# Altium project ChiptunePlayer-2.22-AudioShieldAYYM.PrjPCB
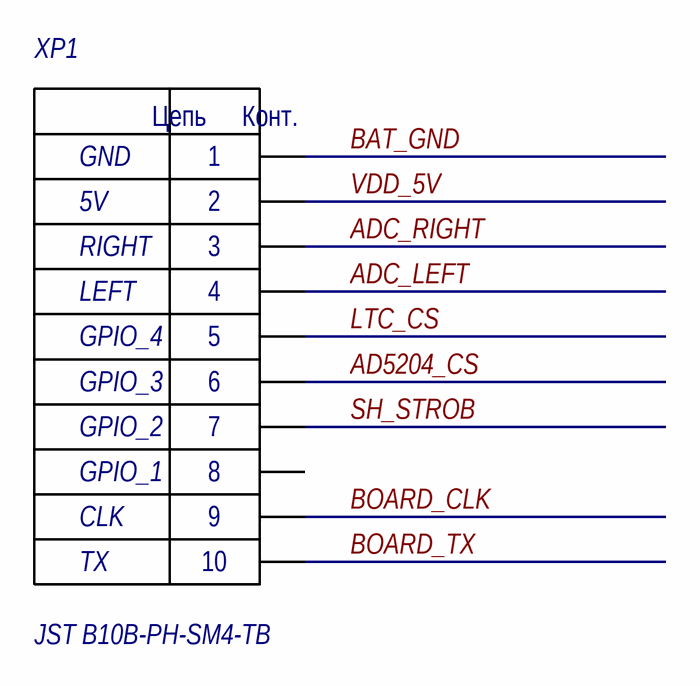
[diagram p0: Connectors.SchDoc]
10 sheets, 77 parts. Net scope: global (net labels, ports and power ports of the same name join across sheets).
Board file: Main.PcbDoc
Sheets:
  Connectors.SchDoc
  Power5VManagement.SchDoc
  Mixer.SchDoc
  ShiftRegister.SchDoc
  Generator28.SchDoc
  Generator40.SchDoc
  DigitalPotentiometers.SchDoc
  AudioAmplifier.SchDoc
  Adc.SchDoc
  ClockGenerator.SchDoc

## Sheet Connectors.SchDoc
size 420 x 297 mm; DocumentNumber: Connectors

### Parts
XP1  JST B10B-PH-SM4-TB  [B10B-PH-SM4-TB]

### Nets
BAT_GND: XP1.1
VDD_5V: XP1.2
AD5204_CS: XP1.6
ADC_LEFT: XP1.4
ADC_RIGHT: XP1.3
BOARD_CLK: XP1.9
BOARD_TX: XP1.10
LTC_CS: XP1.5
SH_STROB: XP1.7

Not connected (* = marked no-connect by the designer): XP1 8

### Notes on the sheet
- GND
- RIGHT
- 5V
- GPIO_3
- GPIO_4
- LEFT
- GPIO_1
- GPIO_2
- TX
- CLK
- Подп. и дата
- Инв. № дубл.
- Взам. инв. №
- Инв. № подл.
- Лист
- Изм.
- № докум.
- Подп.
- Дата
- Копировал
- Формат А3
- (in symbol JST B10B-PH-SM4-TB) Цепь; Конт.

### Library data of the parts
XP1 = JST B10B-PH-SM4-TB: PLS connector; Manufacturer: NONAME; Connector type: Вилка на плату; Number of contacts: 10; Type: Разъем штыревой

## Sheet Power5VManagement.SchDoc
size 420 x 297 mm; DocumentNumber: PowerManagement
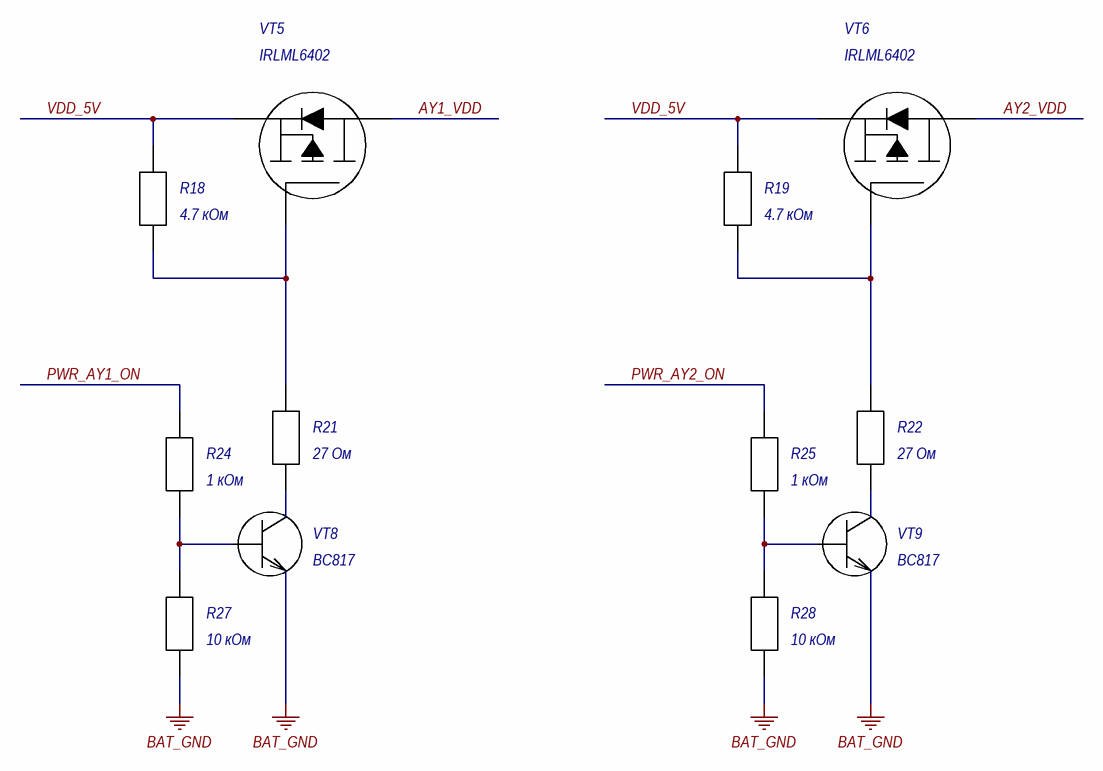
[diagram p1: Power5VManagement.SchDoc]

### Parts
R18  4.7 кОм  [RES 0402]
R19  4.7 кОм  [RES 0402]
R21  27 Ом  [RES 0402]
R22  27 Ом  [RES 0402]
R24  1 кОм  [RES 0402]
R25  1 кОм  [RES 0402]
R27  10 кОм  [RES 0402]
R28  10 кОм  [RES 0402]
VT5  IRLML6402  [SOT-23]
VT6  IRLML6402  [SOT-23]
VT8  BC817  [SOT-23]
VT9  BC817  [SOT-23]

### Nets
AY1_VDD: VT5.3(D)
AY2_VDD: VT6.3(D)
BAT_GND: R27.1 R28.1 VT8.2(E) VT9.2(E)
VDD_5V: R18.2 R19.2 VT5.2(S) VT6.2(S)
PWR_AY1_ON: R24.2
PWR_AY2_ON: R25.2
NetR18_1: R18.1 R21.2 VT5.1(G)
NetR19_1: R19.1 R22.2 VT6.1(G)
NetR21_1: R21.1 VT8.3(C)
NetR22_1: R22.1 VT9.3(C)
NetR24_1: R24.1 R27.2 VT8.1(B)
NetR25_1: R25.1 R28.2 VT9.1(B)

### Notes on the sheet
- Подп. и дата
- Инв. № дубл.
- Взам. инв. №
- Инв. № подл.
- Лист
- Изм.
- № докум.
- Подп.
- Дата
- Копировал
- Формат А3

### Library data of the parts
R18 R19 R21 R22 R24 R25 R27 R28 = RES 0402
VT8 VT9 = BC817: NPN general-purpose transistor; Manufacturer: NXP; Structure: n-p-n; Type: Транзистор биполярный; hFE: 160 ... 600; Max collector-emitter voltage: 45 В; Max collector-base voltage: 50 В; Max emitter-base voltage: 5 В; Max collector current: 0,5 А; Max collector peak current: 1 А; Power dissitipation: 0,25 Вт; fT: 100 МГц; Collector-emitter saturation voltage: 0,7 В; Base-emitter on voltage: 1,2 В; Specitication: ЭКБ ИП; Collector-base сapacitance: 3 пФ; Complement: BC807; Temperature range: -65 ... 150 °C

## Sheet Mixer.SchDoc
size 420 x 297 mm; DocumentNumber: Audio output
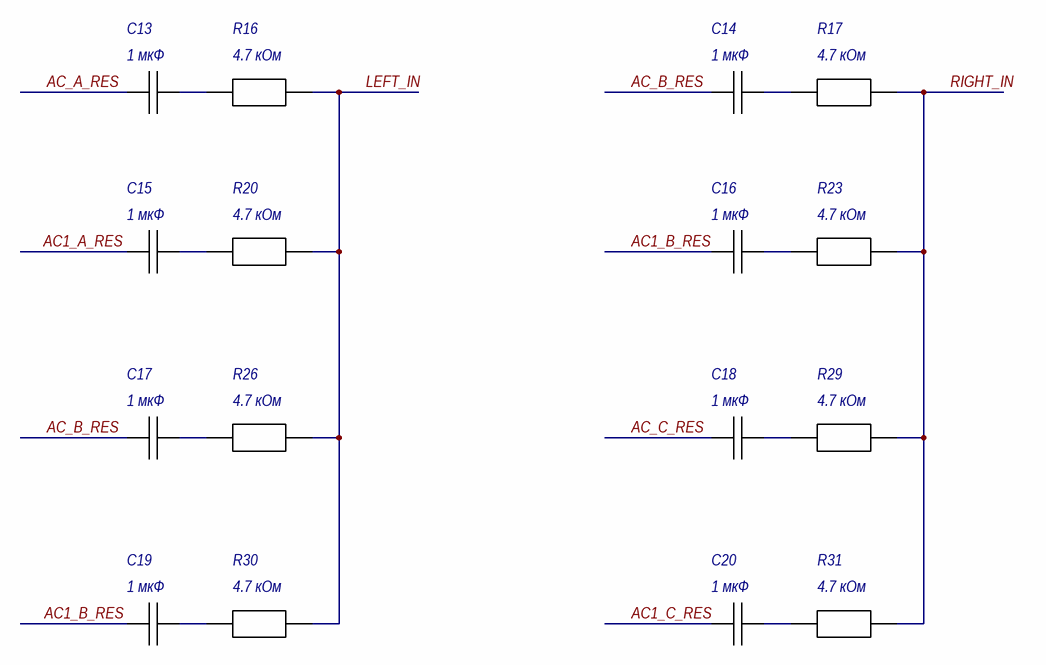
[diagram p2: Mixer.SchDoc]

### Parts
C13  1 мкФ  [C 1206]
C14  1 мкФ  [C 1206]
C15  1 мкФ  [C 1206]
C16  1 мкФ  [C 1206]
C17  1 мкФ  [C 1206]
C18  1 мкФ  [C 1206]
C19  1 мкФ  [C 1206]
C20  1 мкФ  [C 1206]
R16  4.7 кОм  [RES 0805]
R17  4.7 кОм  [RES 0805]
R20  4.7 кОм  [RES 0805]
R23  4.7 кОм  [RES 0805]
R26  4.7 кОм  [RES 0805]
R29  4.7 кОм  [RES 0805]
R30  4.7 кОм  [RES 0805]
R31  4.7 кОм  [RES 0805]

### Nets
AC1_A_RES: C15.1
AC1_B_RES: C16.1 C19.1
AC1_C_RES: C20.1
AC_A_RES: C13.1
AC_B_RES: C14.1 C17.1
AC_C_RES: C18.1
LEFT_IN: R16.2 R20.2 R26.2 R30.2
RIGHT_IN: R17.2 R23.2 R29.2 R31.2
NetC13_2: C13.2 R16.1
NetC14_2: C14.2 R17.1
NetC15_2: C15.2 R20.1
NetC16_2: C16.2 R23.1
NetC17_2: C17.2 R26.1
NetC18_2: C18.2 R29.1
NetC19_2: C19.2 R30.1
NetC20_2: C20.2 R31.1

### Notes on the sheet
- Подп. и дата
- Инв. № дубл.
- Взам. инв. №
- Инв. № подл.
- Лист
- Изм.
- № докум.
- Подп.
- Дата
- Копировал
- Формат А3

### Library data of the parts
C13-C20 = CAP 1206: SMD Capacitor 1206; Manufacturer: /Укажите компанию-производителя/; Tolerance: /Укажите допуск в процентах/; Temperature coefficient: /Формат: ±? ppm/°C/; Type: Конденсатор керамический; TC: /Укажите тип диэлектрика/; Size: 1206; Temperature range: /Формат: -? ... ? °C/
R16 R17 R20 R23 R26 R29-R31 = RES 0805

## Sheet ShiftRegister.SchDoc
size 420 x 297 mm; DocumentNumber: Audio core
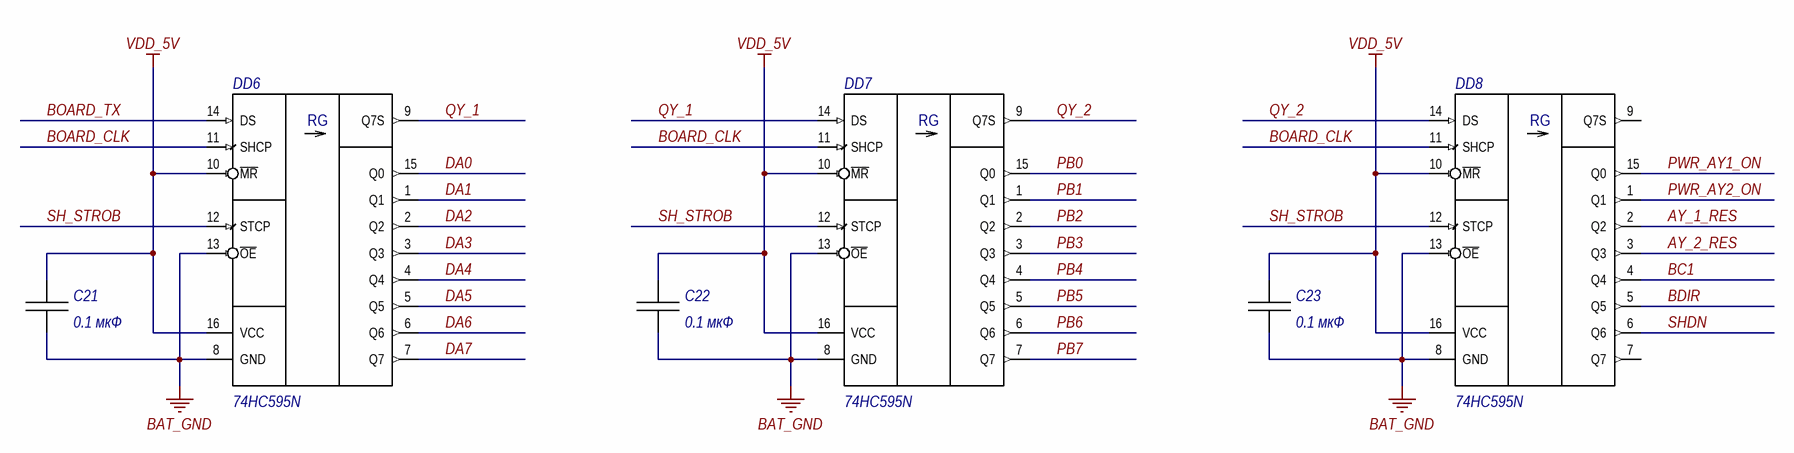
[diagram p3: ShiftRegister.SchDoc]

### Parts
C21  0.1 мкФ  [C 1206]
C22  0.1 мкФ  [C 1206]
C23  0.1 мкФ  [C 1206]
DD6  74HC595N  [SO16]
DD7  74HC595N  [SO16]
DD8  74HC595N  [SO16]

### Nets
BAT_GND: C21.2 C22.2 C23.2 DD6.8(GND) DD6.13(~{OE}) DD7.8(GND) DD7.13(~{OE}) DD8.8(GND) DD8.13(~{OE})
VDD_5V: C21.1 C22.1 C23.1 DD6.10(~{MR}) DD6.16(VCC) DD7.10(~{MR}) DD7.16(VCC) DD8.10(~{MR}) DD8.16(VCC)
AY_1_RES: DD8.2(Q2)
AY_2_RES: DD8.3(Q3)
BC1: DD8.4(Q4)
BDIR: DD8.5(Q5)
BOARD_CLK: DD6.11(SHCP) DD7.11(SHCP) DD8.11(SHCP)
BOARD_TX: DD6.14(DS)
DA0: DD6.15(Q0)
DA1: DD6.1(Q1)
DA2: DD6.2(Q2)
DA3: DD6.3(Q3)
DA4: DD6.4(Q4)
DA5: DD6.5(Q5)
DA6: DD6.6(Q6)
DA7: DD6.7(Q7)
PB0: DD7.15(Q0)
PB1: DD7.1(Q1)
PB2: DD7.2(Q2)
PB3: DD7.3(Q3)
PB4: DD7.4(Q4)
PB5: DD7.5(Q5)
PB6: DD7.6(Q6)
PB7: DD7.7(Q7)
PWR_AY1_ON: DD8.15(Q0)
PWR_AY2_ON: DD8.1(Q1)
QY_1: DD6.9(Q7S) DD7.14(DS)
QY_2: DD7.9(Q7S) DD8.14(DS)
SH_STROB: DD6.12(STCP) DD7.12(STCP) DD8.12(STCP)
SHDN: DD8.6(Q6)

Not connected (* = marked no-connect by the designer): DD8 7(Q7) 9(Q7S)

### Notes on the sheet
- Подп. и дата
- Инв. № дубл.
- Взам. инв. №
- Инв. № подл.
- Лист
- Изм.
- № докум.
- Подп.
- Дата
- Копировал
- Формат А3
- (in symbol 74HC595N) RG

### Library data of the parts
C21-C23 = CAP 1206: as C13 on sheet Mixer; Size: 1206; Temperature range: /Формат: -? ... ? °C/; Value: 0.1 мкФ

## Sheet Generator28.SchDoc
size 420 x 297 mm; DocumentNumber: Audio core
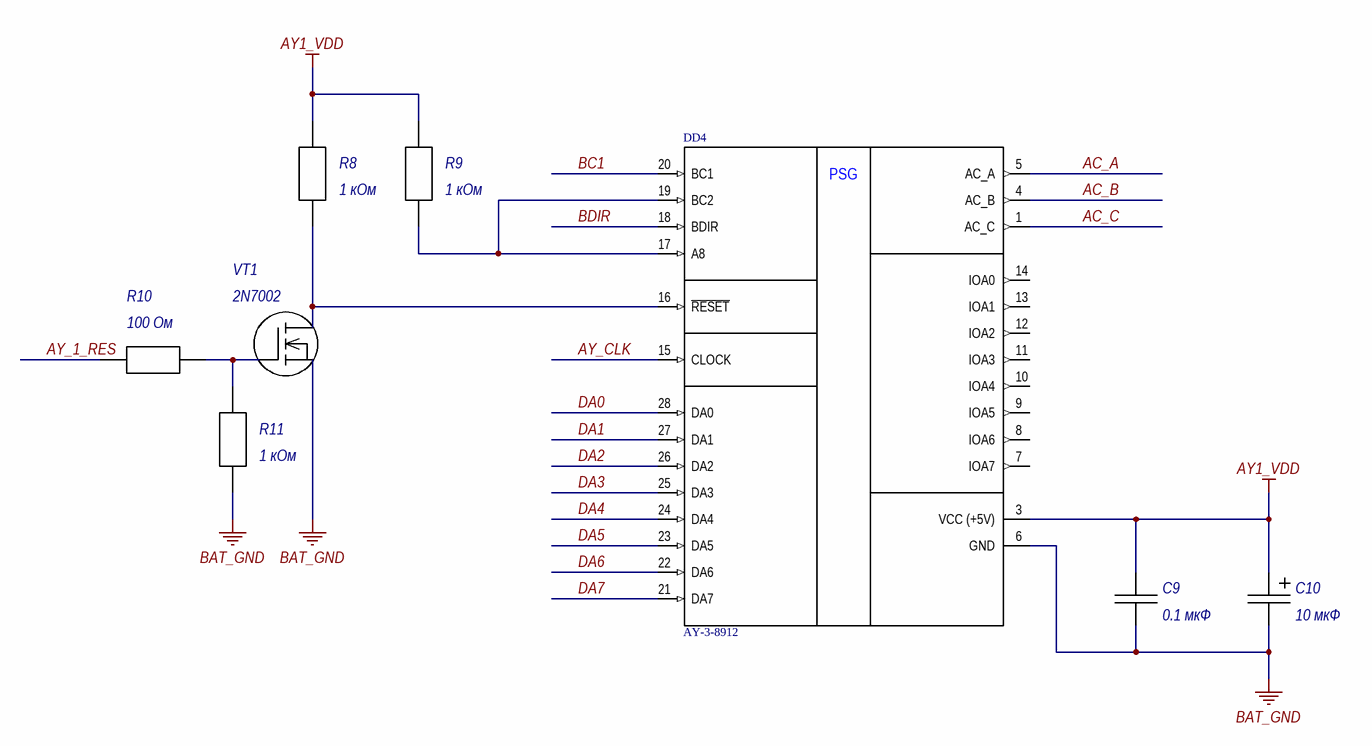
[diagram p4: Generator28.SchDoc]

### Parts
C9  0.1 мкФ  [C 1206]
C10  10 мкФ  [C TAN_A]
DD4  AY-3-8912  [DIP28_PLUS_MCU]
R8  1 кОм  [RES 0805]
R9  1 кОм  [RES 0805]
R10  100 Ом  [RES 0805]
R11  1 кОм  [RES 0805]
VT1  2N7002  [SOT-23]

### Nets
AY1_VDD: C9.1 C10.1 DD4.3(VCC_(+5V)) R8.2 R9.1
BAT_GND: C9.2 C10.2 DD4.6(GND) R11.1 VT1.2(S)
AC_A: DD4.5(AC_A)
AC_B: DD4.4(AC_B)
AC_C: DD4.1(AC_C)
AY_1_RES: R10.1
AY_CLK: DD4.15(CLOCK)
BC1: DD4.20(BC1)
BDIR: DD4.18(BDIR)
DA0: DD4.28(DA0)
DA1: DD4.27(DA1)
DA2: DD4.26(DA2)
DA3: DD4.25(DA3)
DA4: DD4.24(DA4)
DA5: DD4.23(DA5)
DA6: DD4.22(DA6)
DA7: DD4.21(DA7)
NetDD4_16: DD4.16(~{RESET}) R8.1 VT1.3(D)
NetDD4_17: DD4.17(A8) DD4.19(BC2) R9.2
NetR10_2: R10.2 R11.2 VT1.1(G)

Not connected (* = marked no-connect by the designer): DD4 7(IOA7) 8(IOA6) 9(IOA5) 10(IOA4) 11(IOA3) 12(IOA2) 13(IOA1) 14(IOA0)

### Notes on the sheet
- Подп. и дата
- Инв. № дубл.
- Взам. инв. №
- Инв. № подл.
- Лист
- Изм.
- № докум.
- Подп.
- Дата
- Копировал
- Формат А3
- (in symbol AY-3-8912) PSG

### Library data of the parts
C9 = CAP 1206: as C13 on sheet Mixer; Size: 1206; Temperature range: /Формат: -? ... ? °C/; Value: 0.1 мкФ
C10 = CAP TAN_A: SMD Tantalium Capacitor A; Type: Конденсатор танталовый; Rated voltage: 10 В; Size: A
R8-R11 = RES 0805
VT1 = 2N7002: 60 V, 300 mA N-channel Trench MOSFET; Manufacturer: NXP; Structure: Индуцированный канал n-типа; Type: Транзистор полевой с изолированным затвором; Max gate-to-source voltage: 30 В; Drain-to-source breakdown voltage: 60 В; Gate threshold voltage: 2 В; Max continuous drain current: 300 мА; Max pulsed drain current: 1,2 А; Power dissitipation: 0,83 Вт; Input capacitance: 31 пФ; Output capacitance: 6,8 пФ; Turn-on time: 2,5 нс; Reverse transfer capacitance: 3,5 пФ; Turn-off time: 11 нс; Rds: 2,8 Ом; Temperature range: -65 ... 150 °C

## Sheet Generator40.SchDoc
size 420 x 297 mm; DocumentNumber: Audio core
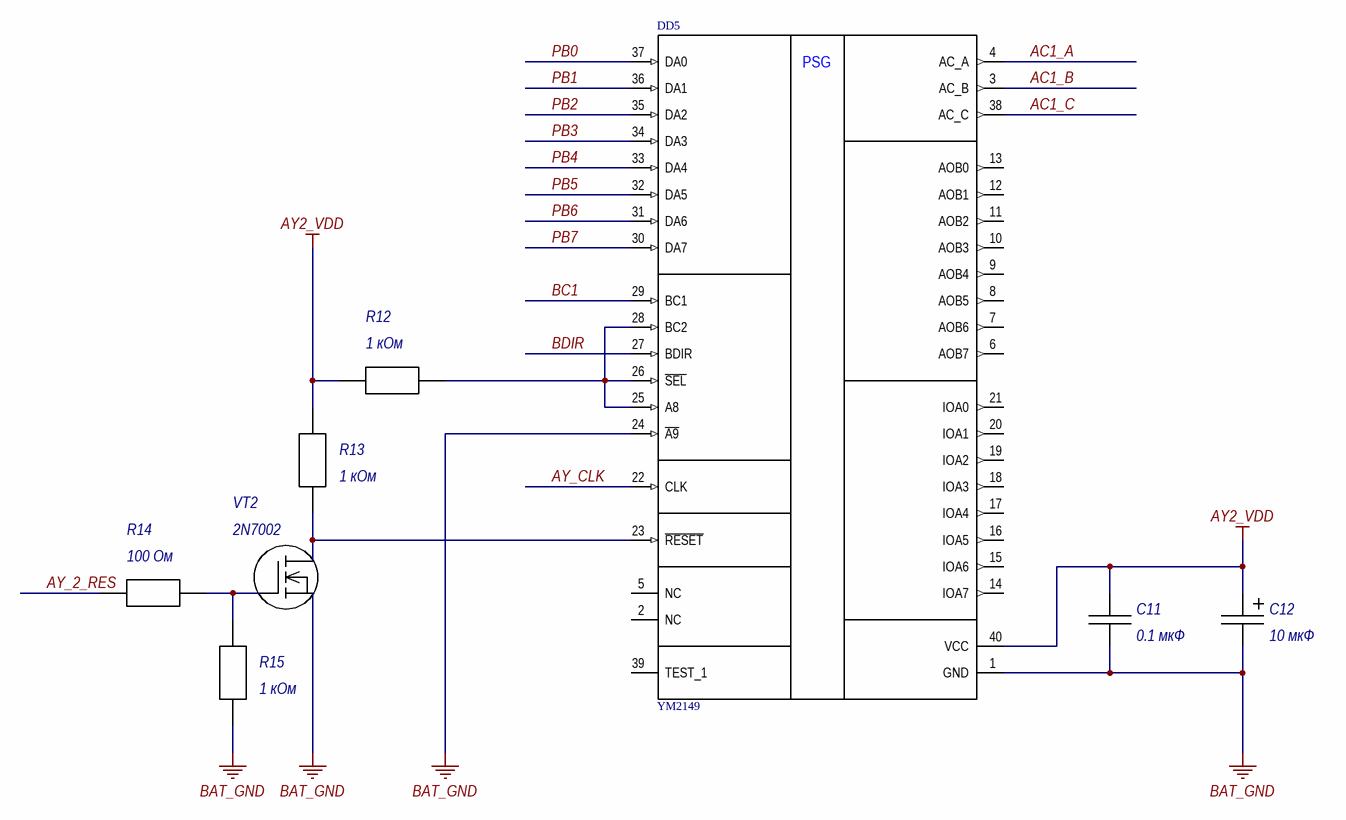
[diagram p5: Generator40.SchDoc]

### Parts
C11  0.1 мкФ  [C 1206]
C12  10 мкФ  [C TAN_A]
DD5  YM2149  [DIP40_PLUS_MCU]
R12  1 кОм  [RES 0805]
R13  1 кОм  [RES 0805]
R14  100 Ом  [RES 0805]
R15  1 кОм  [RES 0805]
VT2  2N7002  [SOT-23]

### Nets
AY2_VDD: C11.1 C12.1 DD5.40(VCC) R12.2 R13.2
BAT_GND: C11.2 C12.2 DD5.1(GND) DD5.24(~{A9}) R15.1 VT2.2(S)
AC1_A: DD5.4(AC_A)
AC1_B: DD5.3(AC_B)
AC1_C: DD5.38(AC_C)
AY_2_RES: R14.1
AY_CLK: DD5.22(CLK)
BC1: DD5.29(BC1)
BDIR: DD5.27(BDIR)
PB0: DD5.37(DA0)
PB1: DD5.36(DA1)
PB2: DD5.35(DA2)
PB3: DD5.34(DA3)
PB4: DD5.33(DA4)
PB5: DD5.32(DA5)
PB6: DD5.31(DA6)
PB7: DD5.30(DA7)
NetDD5_23: DD5.23(~{RESET}) R13.1 VT2.3(D)
NetDD5_25: DD5.25(A8) DD5.26(~{SEL}) DD5.28(BC2) R12.1
NetR14_2: R14.2 R15.2 VT2.1(G)

Not connected (* = marked no-connect by the designer): DD5 2(NC) 5(NC) 6(AOB7) 7(AOB6) 8(AOB5) 9(AOB4) 10(AOB3) 11(AOB2) 12(AOB1) 13(AOB0) 14(IOA7) 15(IOA6) 16(IOA5) 17(IOA4) 18(IOA3) 19(IOA2) 20(IOA1) 21(IOA0) 39(TEST_1)

### Notes on the sheet
- Подп. и дата
- Инв. № дубл.
- Взам. инв. №
- Инв. № подл.
- Лист
- Изм.
- № докум.
- Подп.
- Дата
- Копировал
- Формат А3
- (in symbol YM2149) PSG

### Library data of the parts
C11 = CAP 1206: as C13 on sheet Mixer; Size: 1206; Temperature range: /Формат: -? ... ? °C/; Value: 0.1 мкФ
C12 = CAP TAN_A: as C10 on sheet Generator28; Size: A
R12-R15 = RES 0805
VT2 = 2N7002: as VT1 on sheet Generator28; Temperature range: -65 ... 150 °C

## Sheet DigitalPotentiometers.SchDoc
size 420 x 297 mm; DocumentNumber: Audio output
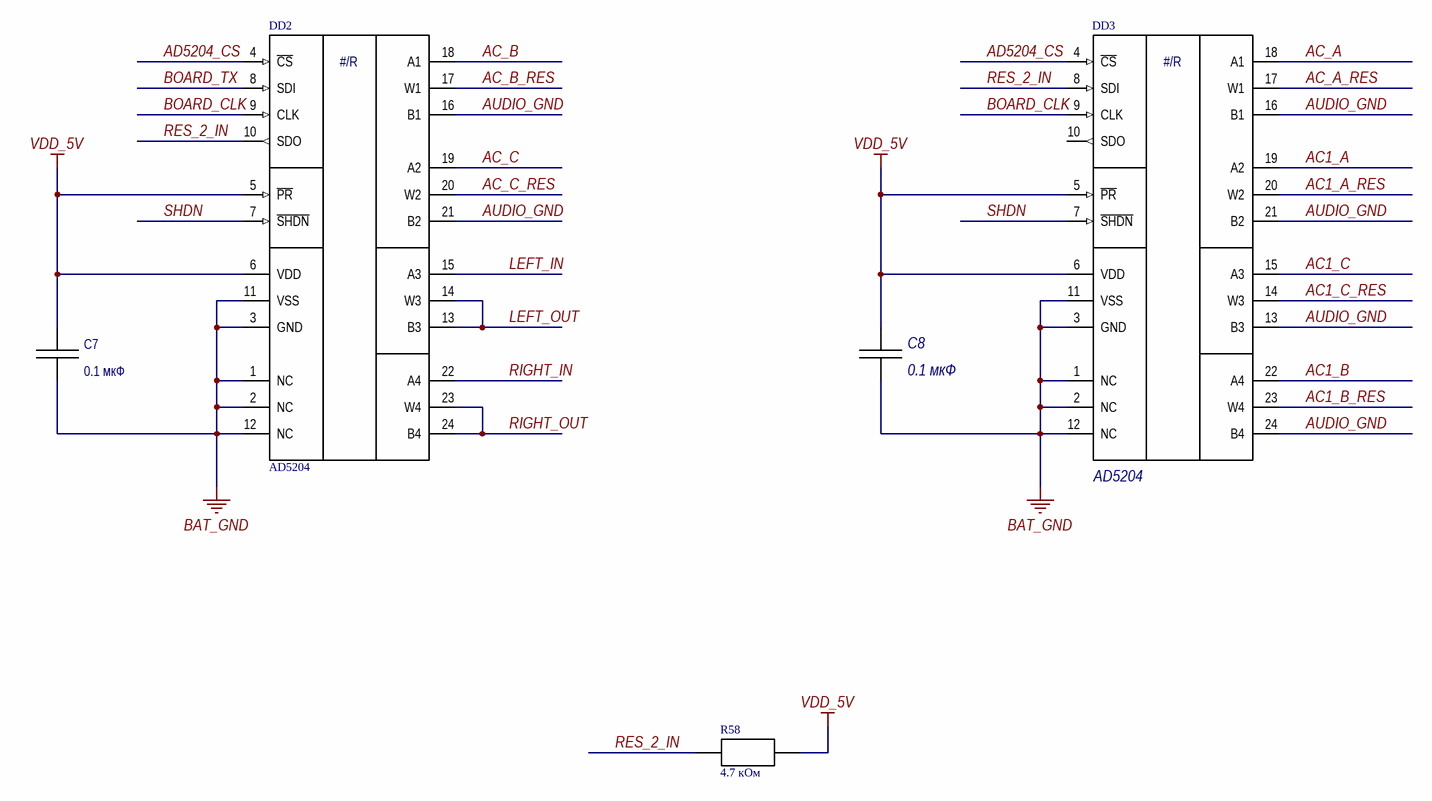
[diagram p6: DigitalPotentiometers.SchDoc]

### Parts
C7  0.1 мкФ  [C 1206]
C8  0.1 мкФ  [C 1206]
DD2  AD5204  [TSSOP-24]
DD3  AD5204  [TSSOP-24]
R58  4.7 кОм  [RES 0805]

### Nets
AUDIO_GND: DD2.16(B1) DD2.21(B2) DD3.13(B3) DD3.16(B1) DD3.21(B2) DD3.24(B4)
BAT_GND: C7.2 C8.2 DD2.1(NC) DD2.2(NC) DD2.3(GND) DD2.11(VSS) DD2.12(NC) DD3.1(NC) DD3.2(NC) DD3.3(GND) DD3.11(VSS) DD3.12(NC)
VDD_5V: C7.1 C8.1 DD2.5(~{PR}) DD2.6(VDD) DD3.5(~{PR}) DD3.6(VDD) R58.2
AC1_A: DD3.19(A2)
AC1_A_RES: DD3.20(W2)
AC1_B: DD3.22(A4)
AC1_B_RES: DD3.23(W4)
AC1_C: DD3.15(A3)
AC1_C_RES: DD3.14(W3)
AC_A: DD3.18(A1)
AC_A_RES: DD3.17(W1)
AC_B: DD2.18(A1)
AC_B_RES: DD2.17(W1)
AC_C: DD2.19(A2)
AC_C_RES: DD2.20(W2)
AD5204_CS: DD2.4(~{CS}) DD3.4(~{CS})
BOARD_CLK: DD2.9(CLK) DD3.9(CLK)
BOARD_TX: DD2.8(SDI)
LEFT_IN: DD2.15(A3)
LEFT_OUT: DD2.13(B3) DD2.14(W3)
RES_2_IN: DD2.10(SDO) DD3.8(SDI) R58.1
RIGHT_IN: DD2.22(A4)
RIGHT_OUT: DD2.23(W4) DD2.24(B4)
SHDN: DD2.7(~{SHDN}) DD3.7(~{SHDN})

Not connected (* = marked no-connect by the designer): DD3 10(SDO)

### Notes on the sheet
- Подп. и дата
- Инв. № дубл.
- Взам. инв. №
- Инв. № подл.
- Лист
- Изм.
- № докум.
- Подп.
- Дата
- Копировал
- Формат А3
- (in symbol AD5204) #/R

### Library data of the parts
C7 C8 = CAP 1206: as C13 on sheet Mixer; Size: 1206; Temperature range: /Формат: -? ... ? °C/; Value: 0.1 мкФ
R58 = RES 0805

## Sheet AudioAmplifier.SchDoc
size 420 x 297 mm; DocumentNumber: Audio output
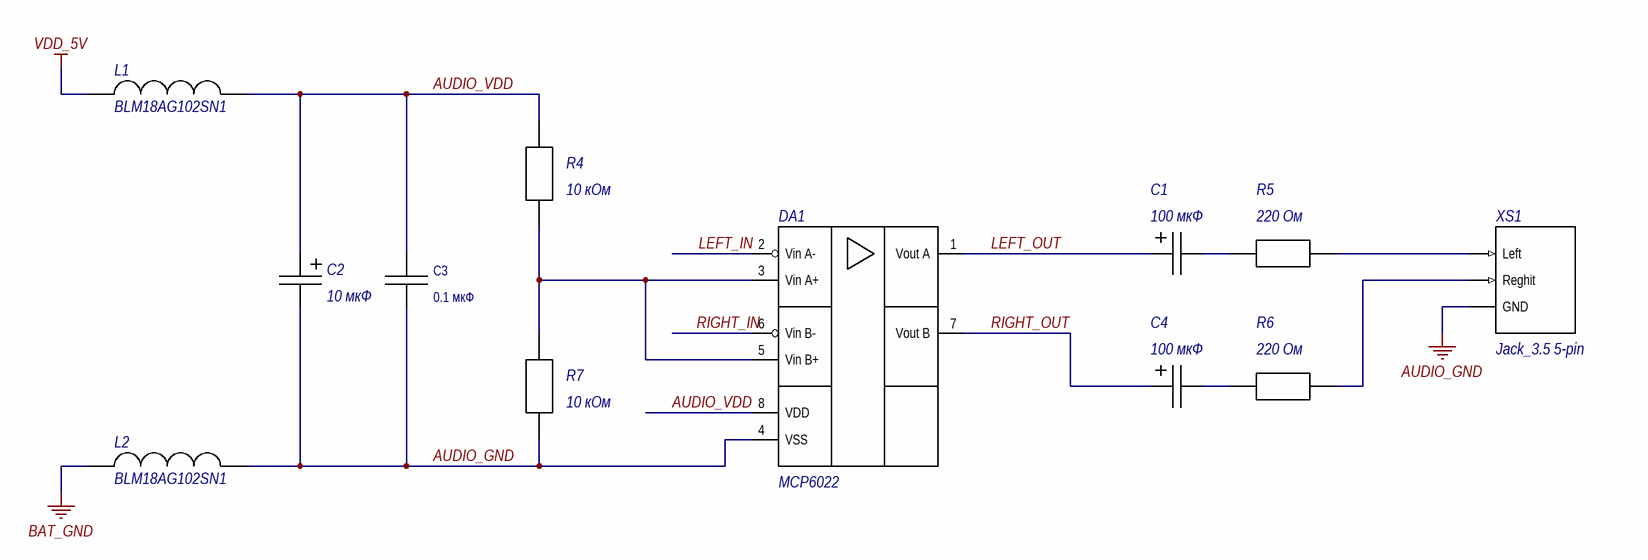
[diagram p7: AudioAmplifier.SchDoc]

### Parts
C1  100 мкФ  [C TAN_C]
C2  10 мкФ  [C TAN_A]
C3  0.1 мкФ  [C 1206]
C4  100 мкФ  [C TAN_C]
DA1  MCP6022  [SOIC-8]
L1  BLM18AG102SN1  [FB 0603]
L2  BLM18AG102SN1  [FB 0603]
R4  10 кОм  [RES 0805]
R5  220 Ом  [RES 0805]
R6  220 Ом  [RES 0805]
R7  10 кОм  [RES 0805]
XS1  Jack_3.5 5-pin  [JACK 3.5 DIP]

### Nets
AUDIO_GND: C2.2 C3.2 DA1.4(VSS) L2.2 R7.1 XS1.G(GND)
BAT_GND: L2.1
VDD_5V: L1.1
AUDIO_VDD: C2.1 C3.1 DA1.8(VDD) L1.2 R4.2
LEFT_IN: DA1.2(Vin_A-)
LEFT_OUT: C1.1 DA1.1(Vout_A)
RIGHT_IN: DA1.6(Vin_B-)
RIGHT_OUT: C4.1 DA1.7(Vout_B)
NetC1_2: C1.2 R5.1
NetC4_2: C4.2 R6.1
NetDA1_3: DA1.3(Vin_A+) DA1.5(Vin_B+) R4.1 R7.2
NetR5_2: R5.2 XS1.L(Left)
NetR6_2: R6.2 XS1.R(Reghit)

### Notes on the sheet
- Подп. и дата
- Инв. № дубл.
- Взам. инв. №
- Инв. № подл.
- Лист
- Изм.
- № докум.
- Подп.
- Дата
- Копировал
- Формат А3

### Library data of the parts
C1 C4 = CAP TAN_C: SMD Tantalium Capacitor C; Type: Конденсатор танталовый; Size: C
C2 = CAP TAN_A: as C10 on sheet Generator28; Size: A
C3 = CAP 1206: as C13 on sheet Mixer; Size: 1206; Temperature range: /Формат: -? ... ? °C/; Value: 0.1 мкФ
R4-R7 = RES 0805

## Sheet Adc.SchDoc
size 420 x 297 mm; DocumentNumber: Audio output
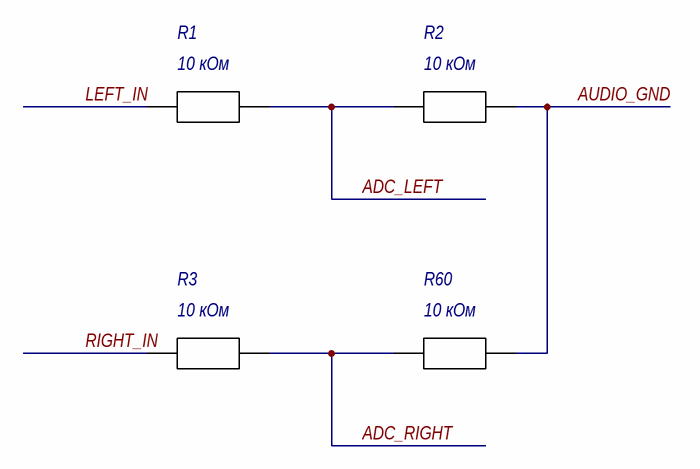
[diagram p8: Adc.SchDoc]

### Parts
R1  10 кОм  [RES 0805]
R2  10 кОм  [RES 0805]
R3  10 кОм  [RES 0805]
R60  10 кОм  [RES 0805]

### Nets
AUDIO_GND: R2.1 R60.1
ADC_LEFT: R1.1 R2.2
ADC_RIGHT: R3.1 R60.2
LEFT_IN: R1.2
RIGHT_IN: R3.2

### Notes on the sheet
- Подп. и дата
- Инв. № дубл.
- Взам. инв. №
- Инв. № подл.
- Лист
- Изм.
- № докум.
- Подп.
- Дата
- Копировал
- Формат А3

### Library data of the parts
R1-R3 R60 = RES 0805

## Sheet ClockGenerator.SchDoc
size 420 x 297 mm; DocumentNumber: ClockGenerator
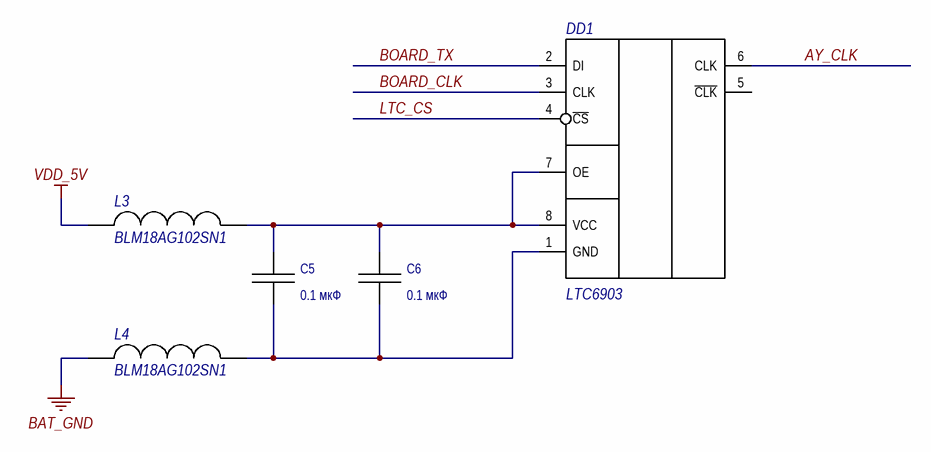
[diagram p9: ClockGenerator.SchDoc]

### Parts
C5  value 0.1 мкФ  [C 1206]  (hidden comment: 1 мкФ)
C6  value 0.1 мкФ  [C 1206]  (hidden comment: 2.2 мкФ)
DD1  LTC6903  [MSOP_MS8]
L3  BLM18AG102SN1  [FB 0603]
L4  BLM18AG102SN1  [FB 0603]

### Nets
BAT_GND: L4.1
VDD_5V: L3.1
AY_CLK: DD1.6(CLK)
BOARD_CLK: DD1.3(CLK)
BOARD_TX: DD1.2(DI)
LTC_CS: DD1.4(~{CS})
NetC5_1: C5.1 C6.1 DD1.7(OE) DD1.8(VCC) L3.2
NetC5_2: C5.2 C6.2 DD1.1(GND) L4.2

Not connected (* = marked no-connect by the designer): DD1 5(~{CLK})

### Notes on the sheet
- Подп. и дата
- Инв. № дубл.
- Взам. инв. №
- Инв. № подл.
- Лист
- Изм.
- № докум.
- Подп.
- Дата
- Копировал
- Формат А3

### Library data of the parts
C5 C6 = CAP 1206: as C13 on sheet Mixer; Size: 1206; Temperature range: /Формат: -? ... ? °C/

## Nets that join several sheets
AUDIO_GND: DigitalPotentiometers (6 pins), AudioAmplifier (6 pins), Adc (R2.1 R60.1)
AY1_VDD: Power5VManagement (VT5.3), Generator28 (5 pins)
AY2_VDD: Power5VManagement (VT6.3), Generator40 (5 pins)
BAT_GND: Connectors (XP1.1), Power5VManagement (R27.1 R28.1 VT8.2 VT9.2), ShiftRegister (9 pins), Generator28 (5 pins), Generator40 (6 pins), DigitalPotentiometers (12 pins), AudioAmplifier (L2.1), ClockGenerator (L4.1)
VDD_5V: Connectors (XP1.2), Power5VManagement (R18.2 R19.2 VT5.2 VT6.2), ShiftRegister (9 pins), DigitalPotentiometers (7 pins), AudioAmplifier (L1.1), ClockGenerator (L3.1)
AC1_A: Generator40 (DD5.4), DigitalPotentiometers (DD3.19)
AC1_A_RES: Mixer (C15.1), DigitalPotentiometers (DD3.20)
AC1_B: Generator40 (DD5.3), DigitalPotentiometers (DD3.22)
AC1_B_RES: Mixer (C16.1 C19.1), DigitalPotentiometers (DD3.23)
AC1_C: Generator40 (DD5.38), DigitalPotentiometers (DD3.15)
AC1_C_RES: Mixer (C20.1), DigitalPotentiometers (DD3.14)
AC_A: Generator28 (DD4.5), DigitalPotentiometers (DD3.18)
AC_A_RES: Mixer (C13.1), DigitalPotentiometers (DD3.17)
AC_B: Generator28 (DD4.4), DigitalPotentiometers (DD2.18)
AC_B_RES: Mixer (C14.1 C17.1), DigitalPotentiometers (DD2.17)
AC_C: Generator28 (DD4.1), DigitalPotentiometers (DD2.19)
AC_C_RES: Mixer (C18.1), DigitalPotentiometers (DD2.20)
AD5204_CS: Connectors (XP1.6), DigitalPotentiometers (DD2.4 DD3.4)
ADC_LEFT: Connectors (XP1.4), Adc (R1.1 R2.2)
ADC_RIGHT: Connectors (XP1.3), Adc (R3.1 R60.2)
AY_1_RES: ShiftRegister (DD8.2), Generator28 (R10.1)
AY_2_RES: ShiftRegister (DD8.3), Generator40 (R14.1)
AY_CLK: Generator28 (DD4.15), Generator40 (DD5.22), ClockGenerator (DD1.6)
BC1: ShiftRegister (DD8.4), Generator28 (DD4.20), Generator40 (DD5.29)
BDIR: ShiftRegister (DD8.5), Generator28 (DD4.18), Generator40 (DD5.27)
BOARD_CLK: Connectors (XP1.9), ShiftRegister (DD6.11 DD7.11 DD8.11), DigitalPotentiometers (DD2.9 DD3.9), ClockGenerator (DD1.3)
BOARD_TX: Connectors (XP1.10), ShiftRegister (DD6.14), DigitalPotentiometers (DD2.8), ClockGenerator (DD1.2)
DA0: ShiftRegister (DD6.15), Generator28 (DD4.28)
DA1: ShiftRegister (DD6.1), Generator28 (DD4.27)
DA2: ShiftRegister (DD6.2), Generator28 (DD4.26)
DA3: ShiftRegister (DD6.3), Generator28 (DD4.25)
DA4: ShiftRegister (DD6.4), Generator28 (DD4.24)
DA5: ShiftRegister (DD6.5), Generator28 (DD4.23)
DA6: ShiftRegister (DD6.6), Generator28 (DD4.22)
DA7: ShiftRegister (DD6.7), Generator28 (DD4.21)
LEFT_IN: Mixer (R16.2 R20.2 R26.2 R30.2), DigitalPotentiometers (DD2.15), AudioAmplifier (DA1.2), Adc (R1.2)
LEFT_OUT: DigitalPotentiometers (DD2.13 DD2.14), AudioAmplifier (C1.1 DA1.1)
LTC_CS: Connectors (XP1.5), ClockGenerator (DD1.4)
PB0: ShiftRegister (DD7.15), Generator40 (DD5.37)
PB1: ShiftRegister (DD7.1), Generator40 (DD5.36)
PB2: ShiftRegister (DD7.2), Generator40 (DD5.35)
PB3: ShiftRegister (DD7.3), Generator40 (DD5.34)
PB4: ShiftRegister (DD7.4), Generator40 (DD5.33)
PB5: ShiftRegister (DD7.5), Generator40 (DD5.32)
PB6: ShiftRegister (DD7.6), Generator40 (DD5.31)
PB7: ShiftRegister (DD7.7), Generator40 (DD5.30)
PWR_AY1_ON: Power5VManagement (R24.2), ShiftRegister (DD8.15)
PWR_AY2_ON: Power5VManagement (R25.2), ShiftRegister (DD8.1)
RIGHT_IN: Mixer (R17.2 R23.2 R29.2 R31.2), DigitalPotentiometers (DD2.22), AudioAmplifier (DA1.6), Adc (R3.2)
RIGHT_OUT: DigitalPotentiometers (DD2.23 DD2.24), AudioAmplifier (C4.1 DA1.7)
SH_STROB: Connectors (XP1.7), ShiftRegister (DD6.12 DD7.12 DD8.12)
SHDN: ShiftRegister (DD8.6), DigitalPotentiometers (DD2.7 DD3.7)